# EAGLE board SL530 (EAGLE 7.6.0), part 1 of 2
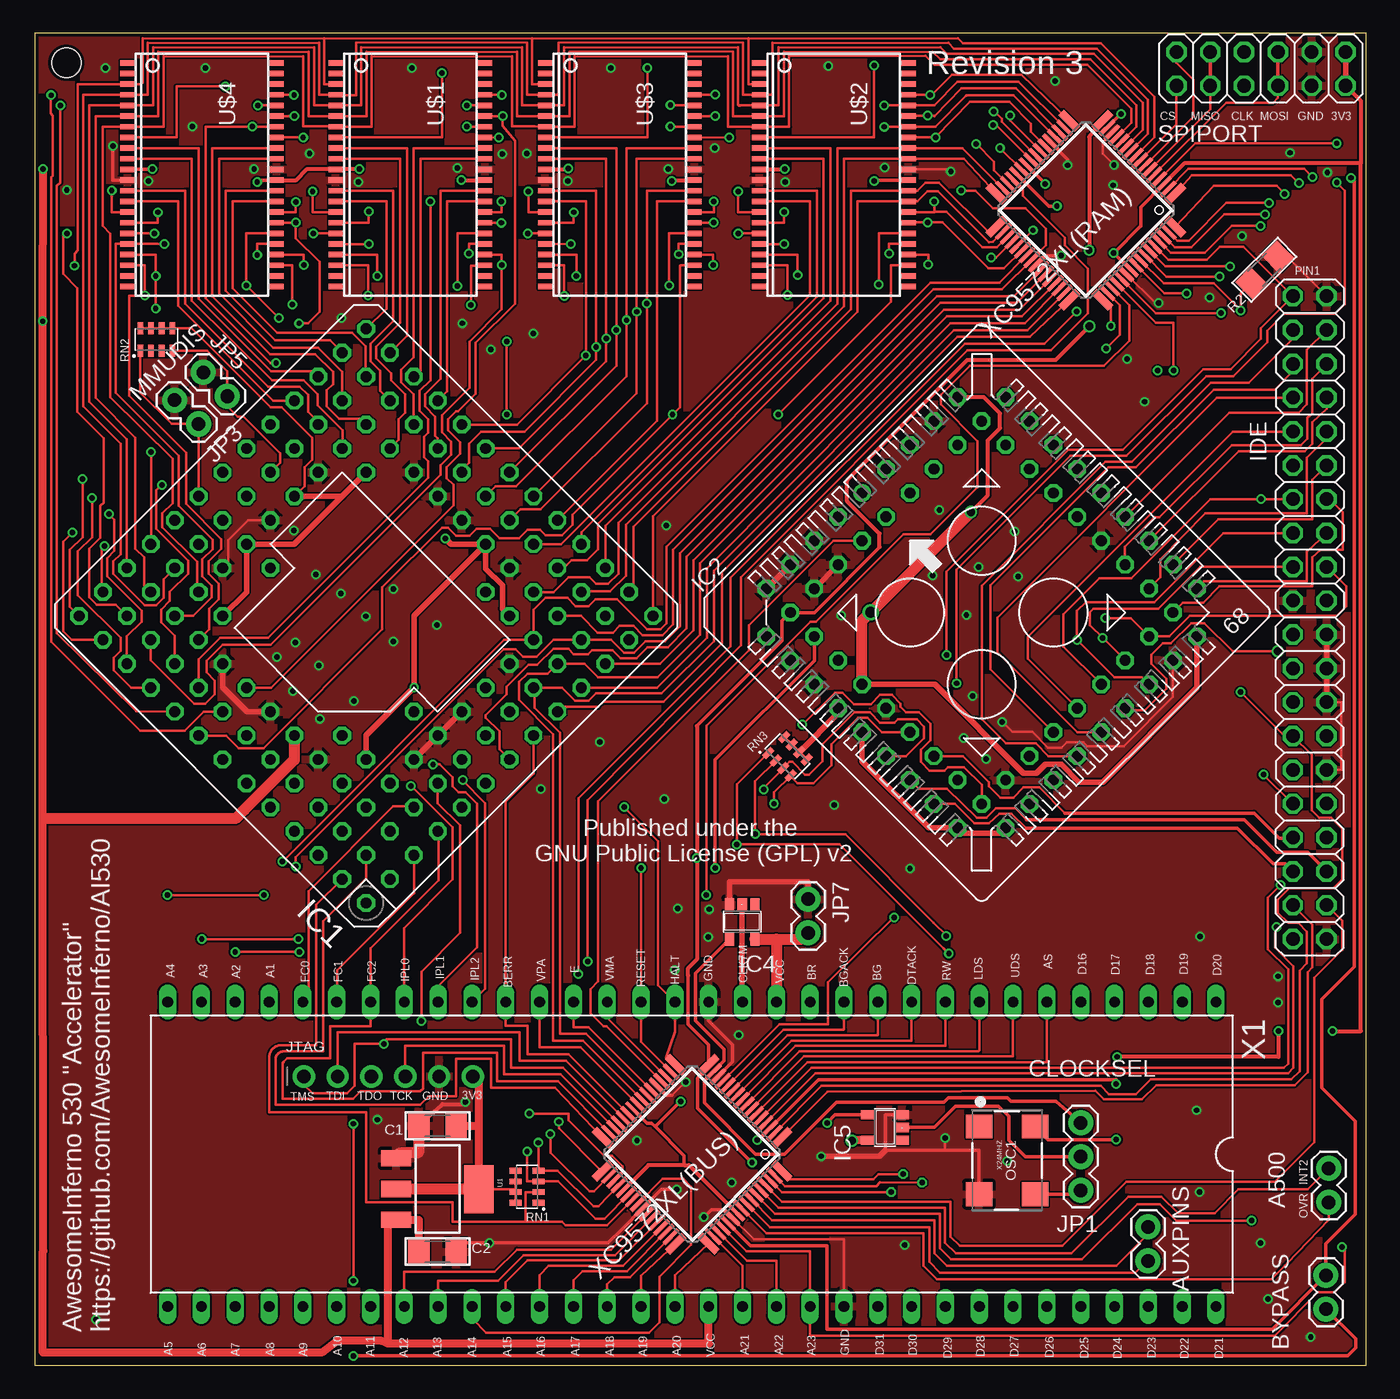
[diagram p3: board, top side]
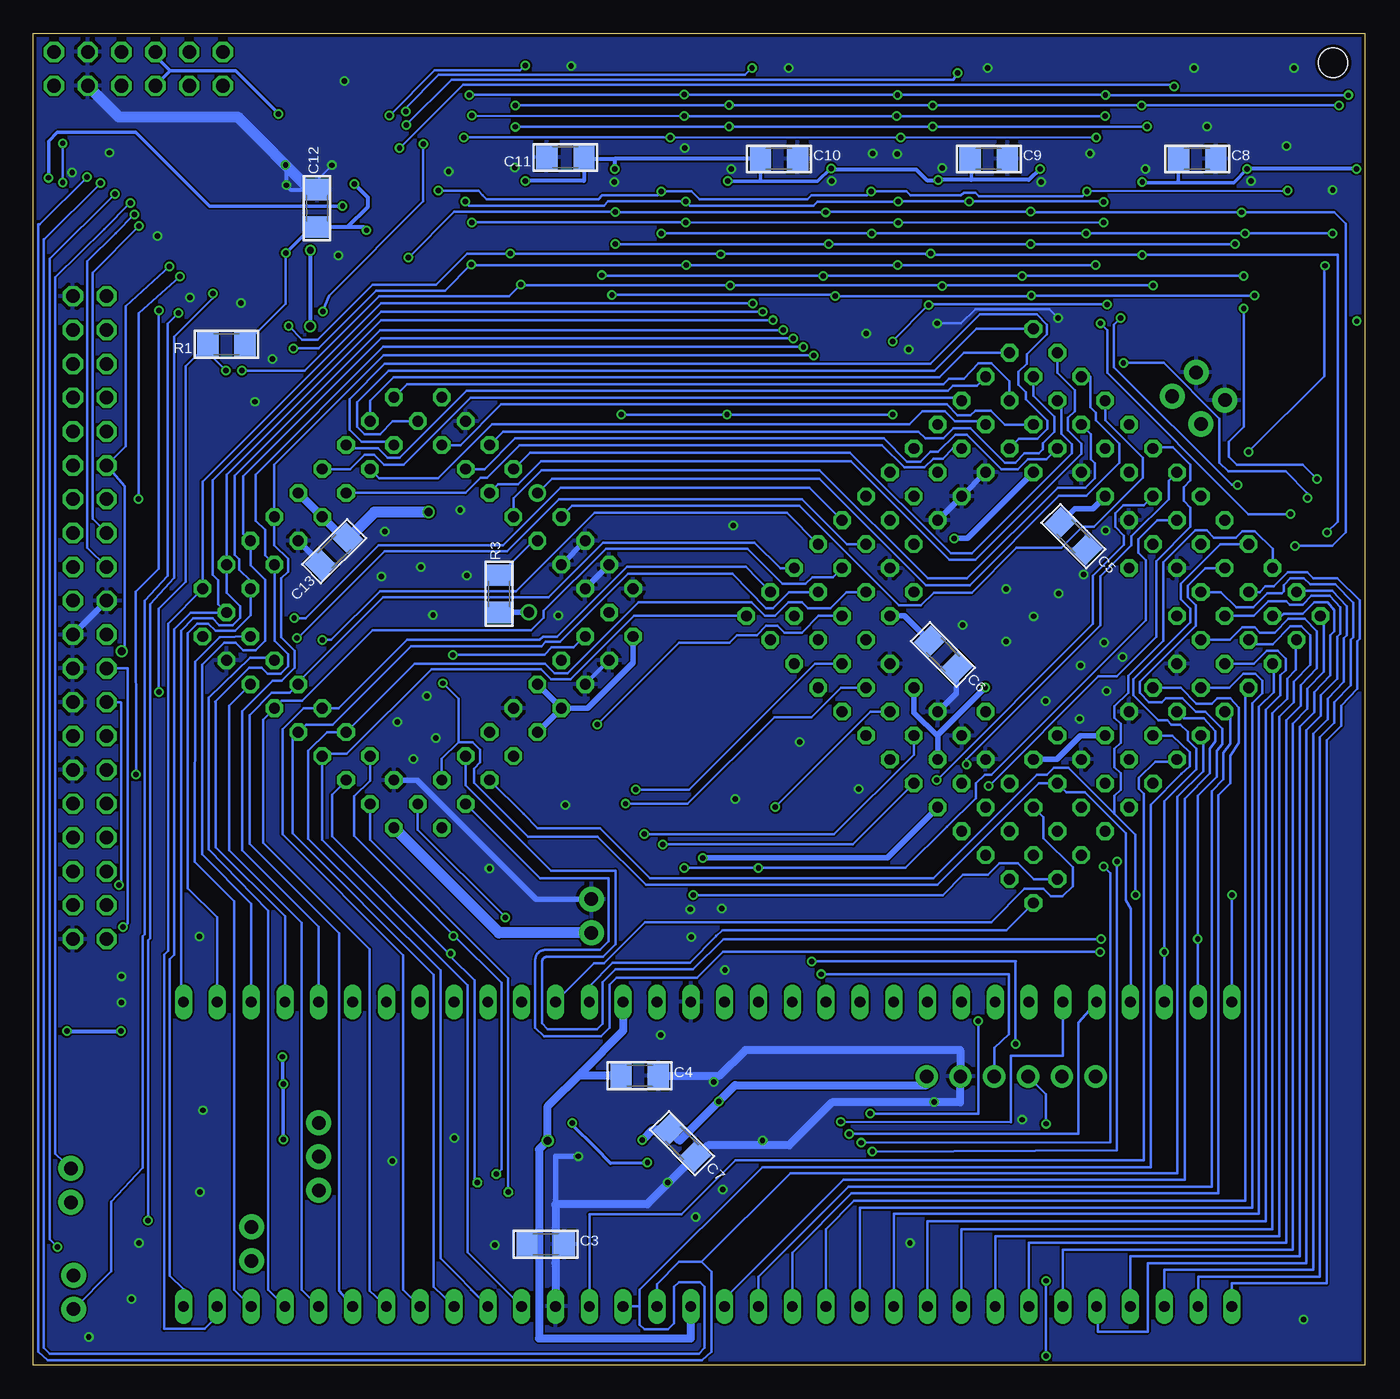
[diagram p4: board, bottom side, seen from below]

Size 100 x 100 mm. Coordinates in mm from the lower left corner, seen from the top.
Outline: 0,0 100,0 100,100 0,100 0,0
Copper layers (1*16): Top 0.035mm / dielectric 1.5mm / Bottom 0.035mm
Design rules "dirt_cheap_dirty_boards.v1 *": minimum track width 5mil, minimum drill 12mil, track to track 5mil, track to pad 5mil, pad to pad 5mil, via to via 5mil, smd to smd 0mil, copper to edge 10mil, drill to drill 10mil, minimum pad ring 10mil, minimum via ring 6mil, stop-mask expansion 2mil, vias tented up to drill 25mil, thermal gap 10mil
Holes 2.2 mm at 2.39,97.79

## Footprints (pad centres in the part's own frame; a part is rotated, then mirrored left to right if it is on the bottom)
1X02 = drill 1.016 pad 1.88: 1 0,0; 2 2.54,0
1206 = smd 1.6 x 1.8: 1 -1.4,0; 2 1.4,0
MPGA128 = drill 0.813 octagon: A01 -15.24,15.24; A02 -12.7,15.24; A03 -10.16,15.24; A04 -7.62,15.24; A05 -5.08,15.24; A06 -2.54,15.24; A07 0,15.24; A08 2.54,15.24; A09 5.08,15.24; A10 7.62,15.24; A11 10.16,15.24; A12 12.7,15.24; A13 15.24,15.24; B01 -15.24,12.7; B02 -12.7,12.7; B03 -10.16,12.7; B04 -7.62,12.7; B05 -5.08,12.7; B06 -2.54,12.7; B07 0,12.7; B08 2.54,12.7; B09 5.08,12.7; B10 7.62,12.7; B11 10.16,12.7; B12 12.7,12.7; B13 15.24,12.7; C01 -15.24,10.16; C02 -12.7,10.16; C03 -10.16,10.16; C04 -7.62,10.16; C05 -5.08,10.16; C06 -2.54,10.16; C07 0,10.16; C08 2.54,10.16; C09 5.08,10.16; C10 7.62,10.16; C11 10.16,10.16; C12 12.7,10.16; C13 15.24,10.16; D01 -15.24,7.62; D02 -12.7,7.62; D03 -10.16,7.62; D04 -7.62,7.62; D05 -5.08,7.62; D10 7.62,7.62; D11 10.16,7.62; D12 12.7,7.62; D13 15.24,7.62; E01 -15.24,5.08; E02 -12.7,5.08; E03 -10.16,5.08; E11 10.16,5.08; E12 12.7,5.08; E13 15.24,5.08; F01 -15.24,2.54; F02 -12.7,2.54; F03 -10.16,2.54; F04 -7.62,2.54; F10 7.62,2.54; F11 10.16,2.54; F12 12.7,2.54; F13 15.24,2.54; G01 -15.24,0; G02 -12.7,0; G03 -10.16,0; G11 10.16,0; G12 12.7,0; G13 15.24,0; H01 -15.24,-2.54; H02 -12.7,-2.54; H03 -10.16,-2.54; H11 10.16,-2.54; H12 12.7,-2.54; H13 15.24,-2.54; J01 -15.24,-5.08; J02 -12.7,-5.08; J03 -10.16,-5.08; J11 10.16,-5.08; J12 12.7,-5.08; J13 15.24,-5.08; K01 -15.24,-7.62; K02 -12.7,-7.62; K03 -10.16,-7.62; K04 -7.62,-7.62; K05 -5.08,-7.62; K10 7.62,-7.62; K11 10.16,-7.62; K12 12.7,-7.62; K13 15.24,-7.62; L01 -15.24,-10.16; L02 -12.7,-10.16; L03 -10.16,-10.16; L04 -7.62,-10.16; L05 -5.08,-10.16; L06 -2.54,-10.16; L07 0,-10.16; L08 2.54,-10.16; L09 5.08,-10.16; L10 7.62,-10.16; L11 10.16,-10.16; L12 12.7,-10.16; L13 15.24,-10.16; M01 -15.24,-12.7; M02 -12.7,-12.7; M03 -10.16,-12.7; M04 -7.62,-12.7; M05 -5.08,-12.7; M06 -2.54,-12.7; M07 0,-12.7; M08 2.54,-12.7; M09 5.08,-12.7; M10 7.62,-12.7; M11 10.16,-12.7; M12 12.7,-12.7; M13 15.24,-12.7; N01 -15.24,-15.24; N02 -12.7,-15.24; N03 -10.16,-15.24; N04 -7.62,-15.24; N05 -5.08,-15.24; N06 -2.54,-15.24; N07 0,-15.24; N08 2.54,-15.24; N09 5.08,-15.24; N10 7.62,-15.24; N11 10.16,-15.24; N12 12.7,-15.24; N13 15.24,-15.24
PLCC68-S = drill 0.813: 1 0,12.7 | drill 0.813 octagon: 2 0,10.16; 3 -2.54,12.7; 4 -2.54,10.16; 5 -5.08,12.7; 6 -5.08,10.16; 7 -7.62,12.7; 8 -7.62,10.16; 9 -10.16,12.7; 10 -12.7,10.16; 11 -10.16,10.16; 12 -12.7,7.62; 13 -10.16,7.62; 14 -12.7,5.08; 15 -10.16,5.08; 16 -12.7,2.54; 17 -10.16,2.54; 18 -12.7,0; 19 -10.16,0; 20 -12.7,-2.54; 21 -10.16,-2.54; 22 -12.7,-5.08; 23 -10.16,-5.08; 24 -12.7,-7.62; 25 -10.16,-7.62; 26 -12.7,-10.16; 27 -10.16,-12.7; 28 -10.16,-10.16; 29 -7.62,-12.7; 30 -7.62,-10.16; 31 -5.08,-12.7; 32 -5.08,-10.16; 33 -2.54,-12.7; 34 -2.54,-10.16; 35 0,-12.7; 36 0,-10.16; 37 2.54,-12.7; 38 2.54,-10.16; 39 5.08,-12.7; 40 5.08,-10.16; 41 7.62,-12.7; 42 7.62,-10.16; 43 10.16,-12.7; 44 12.7,-10.16; 45 10.16,-10.16; 46 12.7,-7.62; 47 10.16,-7.62; 48 12.7,-5.08; 49 10.16,-5.08; 50 12.7,-2.54; 51 10.16,-2.54; 52 12.7,0; 53 10.16,0; 54 12.7,2.54; 55 10.16,2.54; 56 12.7,5.08; 57 10.16,5.08; 58 12.7,7.62; 59 10.16,7.62; 60 12.7,10.16; 61 10.16,12.7; 62 10.16,10.16; 63 7.62,12.7; 64 7.62,10.16; 65 5.08,12.7; 66 5.08,10.16; 67 2.54,12.7; 68 2.54,10.16
SOT23-5 = smd 0.69 x 0.99: 1 -0.95,-1.29; 2 0,-1.29; 3 0.95,-1.29; 4 0.95,1.3; 5 -0.95,1.3
2X20 = drill 1.016 octagon: 1 -24.13,-1.27; 2 -24.13,1.27; 3 -21.59,-1.27; 4 -21.59,1.27; 5 -19.05,-1.27; 6 -19.05,1.27; 7 -16.51,-1.27; 8 -16.51,1.27; 9 -13.97,-1.27; 10 -13.97,1.27; 11 -11.43,-1.27; 12 -11.43,1.27; 13 -8.89,-1.27; 14 -8.89,1.27; 15 -6.35,-1.27; 16 -6.35,1.27; 17 -3.81,-1.27; 18 -3.81,1.27; 19 -1.27,-1.27; 20 -1.27,1.27; 21 1.27,-1.27; 22 1.27,1.27; 23 3.81,-1.27; 24 3.81,1.27; 25 6.35,-1.27; 26 6.35,1.27; 27 8.89,-1.27; 28 8.89,1.27; 29 11.43,-1.27; 30 11.43,1.27; 31 13.97,-1.27; 32 13.97,1.27; 33 16.51,-1.27; 34 16.51,1.27; 35 19.05,-1.27; 36 19.05,1.27; 37 21.59,-1.27; 38 21.59,1.27; 39 24.13,-1.27; 40 24.13,1.27
1X03 = drill 1.016 pad 1.88: 1 0,0; 2 2.54,0; 3 5.08,0
1X06_ROUND = drill 1 pad 1.676: 1 -6.35,0; 2 -3.81,0; 3 -1.27,0; 4 1.27,0; 5 3.81,0; 6 6.35,0
OSC_7X5MM = smd 1.8 x 2: 1 -2.54,-2.1; 2 2.54,-2.1; 3 2.54,2.1; 4 -2.54,2.1
RESCAXE80P320X160-8N = smd 0.9 x 0.425: 1 -0.85,1.2; 2 -0.85,0.4; 3 -0.85,-0.4; 4 -0.85,-1.2; 5 0.85,-1.2; 6 0.85,-0.4; 7 0.85,0.4; 8 0.85,1.2
2X06 = drill 1.016 octagon: 1 -6.35,-1.27; 2 -6.35,1.27; 3 -3.81,-1.27; 4 -3.81,1.27; 5 -1.27,-1.27; 6 -1.27,1.27; 7 1.27,-1.27; 8 1.27,1.27; 9 3.81,-1.27; 10 3.81,1.27; 11 6.35,-1.27; 12 6.35,1.27
SOT223 = smd 1.219 x 2.235: 1 -2.311,-3.099; 2 0,-3.099; 3 2.311,-3.099 | smd 3.6 x 2.2: 4 0,3.099
TSOP44-II = smd 0.4 x 1.092: 1 -8.4,-5.6; 2 -7.6,-5.6; 3 -6.8,-5.6; 4 -6,-5.6; 5 -5.2,-5.6; 6 -4.4,-5.6; 7 -3.6,-5.6; 8 -2.8,-5.6; 9 -2,-5.6; 10 -1.2,-5.6; 11 -0.4,-5.6; 12 0.4,-5.6; 13 1.2,-5.6; 14 2,-5.6; 15 2.8,-5.6; 16 3.6,-5.6; 17 4.4,-5.6; 18 5.2,-5.6; 19 6,-5.6; 20 6.8,-5.6; 21 7.6,-5.6; 22 8.4,-5.6; 23 8.4,5.6; 24 7.6,5.6; 25 6.8,5.6; 26 6,5.6; 27 5.2,5.6; 28 4.4,5.6; 29 3.6,5.6; 30 2.8,5.6; 31 2,5.6; 32 1.2,5.6; 33 0.4,5.6; 34 -0.4,5.6; 35 -1.2,5.6; 36 -2,5.6; 37 -2.8,5.6; 38 -3.6,5.6; 39 -4.4,5.6; 40 -5.2,5.6; 41 -6,5.6; 42 -6.8,5.6; 43 -7.6,5.6; 44 -8.4,5.6
DIL64 = drill 0.813 long: 1 -39.37,-11.43; 2 -36.83,-11.43; 3 -34.29,-11.43; 4 -31.75,-11.43; 5 -29.21,-11.43; 6 -26.67,-11.43; 7 -24.13,-11.43; 8 -21.59,-11.43; 9 -19.05,-11.43; 10 -16.51,-11.43; 11 -13.97,-11.43; 12 -11.43,-11.43; 13 -8.89,-11.43; 14 -6.35,-11.43; 15 -3.81,-11.43; 16 -1.27,-11.43; 17 1.27,-11.43; 18 3.81,-11.43; 19 6.35,-11.43; 20 8.89,-11.43; 21 11.43,-11.43; 22 13.97,-11.43; 23 16.51,-11.43; 24 19.05,-11.43; 25 21.59,-11.43; 26 24.13,-11.43; 27 26.67,-11.43; 28 29.21,-11.43; 29 31.75,-11.43; 30 34.29,-11.43; 31 36.83,-11.43; 32 39.37,-11.43; 33 39.37,11.43; 34 36.83,11.43; 35 34.29,11.43; 36 31.75,11.43; 37 29.21,11.43; 38 26.67,11.43; 39 24.13,11.43; 40 21.59,11.43; 41 19.05,11.43; 42 16.51,11.43; 43 13.97,11.43; 44 11.43,11.43; 45 8.89,11.43; 46 6.35,11.43; 47 3.81,11.43; 48 1.27,11.43; 49 -1.27,11.43; 50 -3.81,11.43; 51 -6.35,11.43; 52 -8.89,11.43; 53 -11.43,11.43; 54 -13.97,11.43; 55 -16.51,11.43; 56 -19.05,11.43; 57 -21.59,11.43; 58 -24.13,11.43; 59 -26.67,11.43; 60 -29.21,11.43; 61 -31.75,11.43; 62 -34.29,11.43; 63 -36.83,11.43; 64 -39.37,11.43
VQ64 = smd 1.754 x 0.554: 1 -5.627,3.877; 16 -5.627,-3.877; 33 5.627,-3.877; 48 5.627,3.877 | smd 1.5 x 0.3: 2 -5.5,3.25; 3 -5.5,2.75; 4 -5.5,2.25; 5 -5.5,1.75; 6 -5.5,1.25; 7 -5.5,0.75; 8 -5.5,0.25; 9 -5.5,-0.25; 10 -5.5,-0.75; 11 -5.5,-1.25; 12 -5.5,-1.75; 13 -5.5,-2.25; 14 -5.5,-2.75; 15 -5.5,-3.25; 34 5.5,-3.25; 35 5.5,-2.75; 36 5.5,-2.25; 37 5.5,-1.75; 38 5.5,-1.25; 39 5.5,-0.75; 40 5.5,-0.25; 41 5.5,0.25; 42 5.5,0.75; 43 5.5,1.25; 44 5.5,1.75; 45 5.5,2.25; 46 5.5,2.75; 47 5.5,3.25 | smd 0.554 x 1.754: 17 -3.877,-5.627; 32 3.877,-5.627; 49 3.877,5.627; 64 -3.877,5.627 | smd 0.3 x 1.5: 18 -3.25,-5.5; 19 -2.75,-5.5; 20 -2.25,-5.5; 21 -1.75,-5.5; 22 -1.25,-5.5; 23 -0.75,-5.5; 24 -0.25,-5.5; 25 0.25,-5.5; 26 0.75,-5.5; 27 1.25,-5.5; 28 1.75,-5.5; 29 2.25,-5.5; 30 2.75,-5.5; 31 3.25,-5.5; 50 3.25,5.5; 51 2.75,5.5; 52 2.25,5.5; 53 1.75,5.5; 54 1.25,5.5; 55 0.75,5.5; 56 0.25,5.5; 57 -0.25,5.5; 58 -0.75,5.5; 59 -1.25,5.5; 60 -1.75,5.5; 61 -2.25,5.5; 62 -2.75,5.5; 63 -3.25,5.5

## Placement (x,y rotation side)
A500  A500  [1X02]  97.18,12.24 90 top
AUXPINS  AUXPINS  [1X02]  83.62,10.39 270 top
BYPASS  BYPASS  [1X02]  96.98,6.76 270 top
C1  10uF  [1206]  30.25,17.98 180 top
C2  10uF  [1206]  30.25,8.53 0 top
C3  10uF  [1206]  61.52,9.09 0 bottom
C4  10uF  [1206]  54.46,21.74 0 bottom
C5  10uF  [1206]  21.89,62.26 315 bottom
C6  10uF  [1206]  31.67,53.37 315 bottom
C7  10uF  [1206]  51.28,16.69 315 bottom
C8  10uF  [1206]  12.6,90.58 0 bottom
C9  10uF  [1206]  28.24,90.58 0 bottom
C10  10uF  [1206]  43.99,90.58 0 bottom
C11  10uF  [1206]  60.05,90.68 180 bottom
C12  10uF  [1206]  78.69,86.87 90 bottom
C13  10uF  [1206]  77.42,61.11 225 bottom
IC1  [MPGA128]  24.89,56.26 135 top
IC2  [PLCC68-S]  71.12,56.52 45 top
IC4  74LVC1G17DBV  [SOT23-5]  53.14,33.3 180 top
IC5  74LVC1G17DBV  [SOT23-5]  63.86,17.86 90 top
IDE  IDE CONNECTOR  [2X20]  95.76,56.13 270 top
JP1  CLOCKSEL  [1X03]  78.56,18.21 270 top
JP3  MMUDIS  [1X02]  10.52,72.47 315 top
JP5  CDIS  [1X02]  12.67,74.55 315 top
JP7  EXT5V  [1X02]  58.09,35 270 top
JTAG  JTAG  [1X06_ROUND]  26.57,21.69 0 top
OSC1  X24MHZ  [OSC_7X5MM]  73.03,15.39 270 top
R1  47K  [1206]  85.5,76.66 180 bottom
R2  47K  [1206]  92.35,82.25 225 top
R3  10K  [1206]  65.02,57.91 90 bottom
RN1  CAY16-103J4LF  [RESCAXE80P320X160-8N]  36.98,13.41 180 top
RN2  CAY16-103J4LF  [RESCAXE80P320X160-8N]  9.14,77.01 90 top
RN3  CAY16-103J4LF  [RESCAXE80P320X160-8N]  56.54,45.72 45 top
SPIPORT  SPI PORT  [2X06]  92.1,97.33 180 top
U1  LM1117  [SOT223]  30.25,13.23 270 top
U$1  AS7C4096A-12TCN  [TSOP44-II]  28.22,89.38 270 top
U$2  AS7C4096A-12TCN  [TSOP44-II]  60.02,89.38 270 top
U$3  AS7C4096A-12TCN  [TSOP44-II]  43.94,89.38 270 top
U$4  AS7C4096A-12TCN  [TSOP44-II]  12.57,89.38 270 top
X1  MC68000  [DIL64]  49.35,15.85 180 top
XC9572XL(BUS)  XC9572XL-VQ64  [VQ64]  49.38,15.85 225 top
XC9572XL(RAM)  XC9572XL-VQ64  [VQ64]  78.94,86.72 225 top

## Tracks (layer width: path | path; a pad name or v marks a point on that pad's centre or on a via)
A0  (via drill 0.41)
  Top 0.203: IC1.A02 21.16,34.57 21.16,24.03 18.49,24.03 arc90 17.63,23.16 17.63,19 24.89,19 24.89,12.24 31.39,12.24 31.39,10.77 36.88,10.77 | 36.88,10.77 39.62,10.77 39.88,10.52 42.98,10.52 XC9572XL(BUS).39 | RN1.2 36.88,13.01 36.88,10.77 | v50.44,35.31 50.44,48.01 58.27,55.83 58.67,55.83 65.23,62.38 67.26,62.38 70.81,65.94 70.81,69.39 68.07,72.14 68.07,72.85 70.26,75.03 80.31,75.03 82.19,76.91 82.19,79.58 XC9572XL(RAM).51
  Bottom 0.203: IC1.A02 24.87,36.5 26.06,37.69 27.43,37.69 28.3,36.83 30.18,36.83 31.7,35.31 v50.44,35.31
A1  (via drill 0.41, 0.41 pad 0.61)
  Top 0.203: v69.24,51.21 69.24,59.74 77.78,68.28 81.99,68.28 87.99,74.27 90.02,74.27 92.56,76.81 92.56,77.67 93.83,78.94 97.69,78.94 98.4,79.65 98.4,88.19 v97.79,88.8 | XC9572XL(RAM).4 87.15,91.75 v97.79,91.75
  Bottom 0.203: X1.29 17.58,27.3 17.58,34.29 17.93,34.9 17.93,39.93 21.03,43.03 22.43,43.03 IC1.C04 24.48,43.69 32.11,36.07 54,36.07 57.61,39.67 62.84,39.67 66.9,43.74 66.9,44.81 66.45,45.26 66.45,46.23 67,46.79 68.07,46.79 | 68.07,46.79 69.32,45.53 IC2.25 | 68.07,46.79 68.07,50.04 v69.24,51.21 | v97.79,91.75 v97.79,88.8
A2  (via drill 0.41 pad 0.61)
  Top 0.152: 8.12,99.62 21.74,99.62 37.36,99.62 53.59,99.62 69.34,99.62
  Top 0.178: 69.34,99.62 69.7,99.26
  Top 0.203: 74.47,40.34 73.36,41.4 72.44,41.4 71.68,40.69 70.56,40.69 69.11,42.15 IC2.24 | U$1.3 21.74,96.18 21.74,99.62 | 37.36,99.62 37.36,96.18 U$3.3 | 8.12,99.62 8.12,96.28 8.02,96.18 U$4.3 3.25,96.18 3.25,83.72 3,83.46 v3,82.55 | 53.59,99.62 53.59,96.18 U$2.3 | v15.06,31.04 v19.89,31.04 | IC1.D13 8.66,61.65 8.74,61.73 v8.74,68.58 | 69.7,99.26 80.06,99.26 84.07,95.25 84.07,92.2 XC9572XL(RAM).9
  Top 0.254: 74.47,40.34 90.32,40.34 93.02,37.64 93.93,37.64 IDE.35
  Bottom 0.203: IC1.D13 10.84,61.65 13.82,58.67 13.82,57.51 13.11,56.79 13.11,55.78 17.37,51.51 17.37,50.29 15.49,48.41 14.83,48.41 14.53,48.11 13.87,48.11 13.31,47.55 13.31,46.94 12.65,46.28 12.65,44.76 15.06,42.34 v15.06,31.04 X1.30 | IC2.24 61.96,36.58 56.79,36.58 56.79,31.85 57.45,31.19 61.54,31.19 arc-90 62.31,30.43 62.31,25.35 61.65,24.69 57.38,24.69 56.72,25.35 56.72,28.57 56.19,29.11 50.14,29.11 48.21,31.04 v19.89,31.04 | v8.74,68.58 3.05,74.27 3.05,82.5 v3,82.55
A3  (via drill 0.41 pad 0.61)
  Top 0.152: 55.42,99.29 68.61,99.29 | 8.51,99.29 21.36,99.29 | 36.98,99.29 24.13,99.29 | 53.21,99.29 39.34,99.29
  Top 0.178: 68.61,99.29 69.04,98.86
  Top 0.203: 77.37,41.45 75.44,43.38 74.27,43.38 73.51,42.62 72.54,42.62 71.68,43.48 71.68,43.79 69.73,45.74 IC2.23 | 8.51,99.29 8.51,95.38 U$4.4 3.66,95.38 3.66,71.98 6.45,69.19 6.45,60.91 5.89,60.35 5.89,59.44 8.28,57.05 9.14,57.05 9.7,57.61 9.7,59.03 IC1.D12 | 21.36,99.29 21.36,95.38 U$1.4 23.13,95.35 24.13,95.35 24.13,99.29 | 36.98,99.29 36.98,95.38 U$3.4 39.34,95.38 39.34,99.29 | 53.21,99.29 53.21,95.38 U$2.4 54.44,95.4 55.42,95.4 55.42,99.29 | v12.55,32 v19.81,32 | 69.04,98.86 79.76,98.86 83.62,95 83.62,92.45 XC9572XL(RAM).10
  Top 0.254: 77.37,41.45 91.59,41.45 93.47,39.57 94.44,39.57 IDE.33
  Bottom 0.203: IC1.D12 11.98,59.85 13.31,58.52 13.31,57.66 12.7,57.05 12.7,55.52 16.92,51.31 16.92,50.49 16.2,49.78 15.24,49.78 14.94,50.09 13.72,50.09 12.7,49.07 11.99,49.07 10.72,47.8 10.72,46.63 11.12,46.13 11.12,44.2 12.55,42.77 v12.55,32 12.55,27.3 X1.31 | IC2.23 67.53,43.55 61.11,37.13 56.29,37.13 56.29,31.6 57.2,30.68 61.39,30.68 arc-90 61.8,30.28 61.8,25.68 61.37,25.25 57.66,25.25 57.25,25.65 57.25,28.75 56.29,29.72 50.44,29.72 48.16,32 v19.81,32
A4  (via drill 0.41)
  Top 0.152: 55.88,98.96 68.02,98.96 | 39.75,98.96 52.83,98.96 | 8.89,98.96 20.98,98.96 | 24.54,98.96 36.6,98.96
  Top 0.178: 68.02,98.96 68.53,98.45
  Top 0.203: IC2.22 66.39,43.28 68.53,43.28 70.76,41.1 71.48,41.1 72.19,41.81 73.66,41.81 74.47,40.95 | 39.75,98.96 39.75,94.58 U$3.5 36.6,94.59 36.6,98.96 | 52.83,98.96 52.83,94.64 arc90 52.99,94.58 U$2.5 55.88,94.58 55.88,98.96 | 8.89,98.96 8.89,94.58 U$4.5 4.12,94.58 4.12,72.34 6.93,69.52 IC1.C13 | 20.98,98.96 20.98,94.58 U$1.5 24.54,94.58 24.54,98.96 | v17.22,35.31 v9.98,35.31 | 68.53,98.45 79.55,98.45 83.21,94.79 83.21,92.76 XC9572XL(RAM).11
  Top 0.254: 74.47,40.95 90.83,40.95 93.27,38.51 95.61,38.51 IDE.36
  Bottom 0.203: IC1.C13 6.93,61.29 8.28,62.64 9.2,62.64 9.7,62.13 11.33,62.13 11.89,62.69 12.75,62.69 15.14,60.3 15.14,54.41 17.78,51.77 17.78,50.49 18.8,49.48 18.8,48.62 18.34,48.16 18.34,46.74 18.8,46.28 18.8,44.91 18.34,44.45 18.34,43.23 18.8,42.77 18.8,41.4 | v17.22,35.31 17.22,39.83 18.8,41.4 | v9.98,35.31 X1.32 | IC2.22 63.19,41.4 62.13,40.34 57.45,40.34 53.7,36.58 32.41,36.58 24.64,44.35 23.88,44.35 23.37,44.86 22.25,44.86 18.8,41.4
A5
  Top 0.152: 9.27,98.63 20.57,98.63 | 52.45,98.63 40.16,98.63 | 24.92,98.63 36.22,98.63 | 56.29,98.63 67.44,98.63
  Top 0.178: 67.44,98.63 68.02,98.04
  Top 0.203: 56.29,98.63 56.29,93.78 U$2.6 52.45,93.78 52.45,98.63 | 9.27,98.63 9.27,93.78 U$4.6 4.57,93.78 4.57,72.64 7.57,69.65 7.57,61.32 8.23,60.66 8.23,58.55 IC1.C12 | 20.57,98.63 20.57,93.78 23.13,93.78 U$1.6 24.92,93.78 24.92,98.63 | 40.16,98.63 40.16,93.78 37.53,93.78 | 37.53,93.78 U$3.6 | 36.22,98.63 36.22,93.78 37.53,93.78 | 68.02,98.04 79.3,98.04 82.75,94.59 82.75,93 XC9572XL(RAM).12
  Bottom 0.203: X1.33 9.98,6.15 2.87,6.15 2.87,46.91 1.78,48.01 1.78,49.53 0.56,50.8 0.56,54.36 0.38,54.53 0.38,57.45 2.08,59.08 3.86,59.08 4.32,59.54 5.79,59.54 6.86,58.47 7.47,58.47 7.88,58.06 IC1.C12
A6
  Top 0.152: 9.68,98.27 20.17,98.27 | 25.3,98.27 35.84,98.27 | 40.56,98.27 52.07,98.27 | 56.67,98.3 66.9,98.3
  Top 0.178: 66.9,98.3 67.56,97.64
  Top 0.203: 9.68,98.27 9.68,92.98 U$4.7 5.13,92.98 5.13,85.55 5.69,84.94 5.69,72.69 10.36,68.07 10.36,64.72 9.58,63.96 9.58,62.92 12.19,60.33 12.19,58.19 IC1.D11 | 20.17,98.27 20.17,93.02 23.13,93.02 U$1.7 25.3,92.98 25.3,98.27 | 35.84,98.27 35.84,93.02 37.53,93.02 U$3.7 40.56,92.98 40.56,98.27 | 52.07,98.27 52.07,92.98 U$2.7 56.67,92.98 56.67,98.3 | 67.56,97.64 79.05,97.64 82.35,94.34 82.35,93.3 XC9572XL(RAM).13
  Bottom 0.203: X1.34 12.52,6.66 3.38,6.66 3.38,47.17 2.29,48.26 2.29,49.78 1.07,51.05 1.07,54.46 0.86,54.66 0.86,57.25 2.23,58.62 4.12,58.62 4.57,59.08 5.59,59.08 6.1,58.57 6.1,58.12 6.25,57.96 7.32,57.96 8.38,56.9 9.65,56.9 10.81,58.06 IC1.D11
A7  (via drill 0.41, 0.41 pad 0.41, 0.41 pad 0.61)
  Top 0.203: U$2.16 56.29,85.78 v56.29,86.59 | U$3.16 40.49,85.78 v40.49,86.56 | U$1.16 25.09,85.78 v25.09,86.61 | v9.25,86.56 9.25,85.78 U$4.16 | IC1.B13 5.03,58.16 5.03,61.31 v5.23,61.52 | v71.83,83.16 72.2,83.16 XC9572XL(RAM).36
  Bottom 0.203: X1.35 15.06,7.16 3.89,7.16 3.89,47.42 2.79,48.51 2.79,50.04 1.57,51.31 1.57,54.59 1.35,54.81 1.35,57 2.44,58.17 5.03,58.17 IC1.B13 | v71.83,83.16 68.4,86.59 v56.29,86.59 56.29,86.56 v40.49,86.56 40.49,86.61 v25.09,86.61 25.09,86.56 v9.25,86.56 2.29,86.56 1.42,85.7 1.42,62.53 2.44,61.52 v5.23,61.52
A8  (via drill 0.41, 0.41 pad 0.41)
  Top 0.203: U$1.17 v20.93,84.98 | v8.99,84.98 U$4.17 | U$3.17 v37.03,84.98 | v52.83,84.98 U$2.17 | IC1.B12 6.09,57.1 4.67,57.1 4.12,57.66 4.12,61.32 4.93,62.13 4.93,64.52 5.18,64.77 5.18,69.6 3.2,71.58 3.2,80.87 2.13,81.94 2.13,84.98 v2.44,84.98
  Bottom 0.203: v52.83,84.98 v37.03,84.98 v20.93,84.98 v8.99,84.98 v2.44,84.98 | X1.36 17.6,8.18 4.9,8.18 4.9,47.93 3.81,49.02 3.81,50.55 2.59,51.82 2.59,54.81 2.31,55.09 2.31,56.69 2.79,57.3 3.81,57.3 4.67,56.44 6.1,56.44 6.27,56.26 IC1.B12
A9  (via drill 0.41 pad 0.41)
  Top 0.203: v56.29,84.18 54.48,84.18 U$2.18 | v9.75,84.18 9.24,84.18 U$4.18 6.1,84.18 6.1,73 10.82,68.28 10.82,64.52 13.36,61.98 13.36,61.27 12.6,60.5 12.6,59.23 13.31,58.52 13.31,57.66 11.91,56.26 IC1.C11 | v25.09,84.18 23.13,84.18 U$1.18 | v40.28,84.18 U$3.18
  Bottom 0.203: v56.29,84.18 v40.28,84.18 v25.09,84.18 v9.75,84.18 | IC1.C11 8.36,56.26 7.26,57.35 5.89,57.35 5.64,57.1 4.67,57.1 4.01,57.76 2.64,57.76 1.83,56.9 1.83,54.94 2.08,54.69 2.08,51.56 3.3,50.29 3.3,48.77 4.39,47.68 4.39,7.67 16.31,7.67 16.31,2.54 20.07,2.54 20.07,4.42 X1.37
A10  (via drill 0.41 pad 0.41, 0.41 pad 0.61)
  Top 0.203: U$4.19 9.09,83.38 v9.09,81.79 v9.09,79.35 | U$1.19 25.73,83.38 v25.73,81.79 | U$3.19 40.69,83.38 v40.69,81.79 | U$2.19 57.3,83.38 v57.3,81.84 | IC1.A13 2.64,56.96 2.64,61.21 3.61,62.18 v3.61,66.55
  Bottom 0.203: v9.09,81.79 v25.73,81.79 v40.69,81.79 57.3,81.79 v57.3,81.84 | IC1.A13 3.1,56.07 3.1,52.07 4.32,50.8 4.32,49.28 5.41,48.18 5.41,8.69 22.68,8.69 X1.38 | v9.09,79.35 9.09,70.46 10.21,69.34 10.21,68.22 9.6,67.61 4.67,67.61 v3.61,66.55
A11  (via drill 0.41 pad 0.41)
  Top 0.203: U$4.20 8.28,82.58 v8.28,80.31 7.11,80.31 7.11,72.8 11.38,68.53 11.38,64.67 14.02,62.03 14.02,61.32 13.06,60.35 13.06,59.44 13.82,58.67 13.82,57.51 13.11,56.79 13.11,55.25 IC1.C10 | U$1.20 25.04,82.58 v25.04,80.31 | U$3.20 39.78,82.58 v39.78,80.26 | U$2.20 56.54,82.58 v56.54,80.37
  Bottom 0.203: X1.39 25.22,9.2 5.92,9.2 5.92,48.44 4.83,49.53 4.83,51.05 3.61,52.32 3.61,55.12 4.52,56.03 5.74,56.03 6.76,55.02 7.87,55.02 8.28,55.42 9.2,55.42 10.15,54.47 IC1.C10 | v8.28,80.31 v25.04,80.31 25.35,80.31 25.4,80.26 v39.78,80.26 39.88,80.37 v56.54,80.37
A12  (via drill 0.41, 0.41 pad 0.41)
  Top 0.203: U$4.26 20.22,83.38 v20.22,82.6 | U$3.26 50.95,83.38 v50.95,82.6 | U$2.26 67.11,83.38 v67.11,82.65 | X1.40 27.76,7.01 34.54,7.01 36.22,8.69 43.27,8.69 XC9572XL(BUS).42 | U$1.26 35.08,83.38 v35.08,82.6 35.08,79.27 32.66,76.86 32.66,73.41 30.58,71.32 30.58,70.05 31.29,69.34 31.29,68.38 30.48,67.56 30.48,66.85 17.73,54.1 14.12,54.1 12.9,52.88 12.9,52.02 13.51,51.41 13.51,50.39 12.8,49.68 11.99,49.68 8.73,52.94 IC1.B11 | XC9572XL(RAM).50 81.48,79.58 81.48,77.37 v80.47,76.35
  Bottom 0.203: v20.22,82.6 v35.08,82.6 v50.95,82.6 67.11,82.6 v67.11,82.65 69.09,80.67 74.27,80.67 78.59,76.35 v80.47,76.35 | X1.40 27.76,9.7 6.43,9.7 6.43,48.69 5.33,49.78 5.33,51.31 4.12,52.58 4.12,54.81 4.78,55.47 5.59,55.47 6.91,54.15 8.41,54.15 IC1.B11
A13  (via drill 0.41, 0.41 pad 0.41, 0.41 pad 0.61)
  Top 0.203: U$4.27 16.71,84.18 v16.71,83.36 | U$1.27 32.61,84.18 v32.61,83.46 | U$3.27 48.36,84.18 v48.36,83.41 | X1.41 30.3,6.35 34.8,6.35 36.73,8.28 43.58,8.28 XC9572XL(BUS).43 | IC1.A12 2.79,54.47 2.13,55.12 2.13,61.82 v2.85,62.53 | v64.16,83.46 64.16,84.18 U$2.27 | XC9572XL(RAM).49 80.82,79.53 v80.82,78.03
  Bottom 0.203: 48.11,83.46 v32.61,83.46 32.92,83.36 v16.71,83.36 2.03,83.36 2.03,63.35 v2.85,62.53 | 48.11,83.46 v48.36,83.41 | 48.11,83.46 v64.16,83.46 67.41,83.46 69.75,81.13 74.52,81.13 78.64,77.01 79.81,77.01 v80.82,78.03 | X1.41 30.3,10.21 6.93,10.21 6.93,48.95 5.84,50.04 5.84,51.56 5.18,52.22 5.18,54.42 IC1.A12
A14  (via drill 0.41, 0.41 pad 0.41, 0.41 pad 0.61)
  Top 0.203: U$4.28 15.9,84.98 v15.9,81.08 v18.34,78.64 | U$1.28 31.75,84.98 v31.75,81.03 | U$3.28 47.65,84.98 v47.65,81.08 | IC1.B10 10.52,54.75 9.5,55.78 9.5,56.74 10.16,57.4 10.16,58.06 11.53,59.44 11.53,60.4 9.14,62.79 9.14,65.68 v9.55,66.09 | U$2.28 63.4,84.98 v63.4,81.13 | XC9572XL(BUS).40 47.17,13.99 48.72,13.99 49.3,13.41 49.3,9.04 46.91,6.66 46.91,3.23 46.15,2.46 33.91,2.46 32.92,3.45 32.92,4.34 X1.42
  Bottom 0.203: 32.26,81.08 v31.75,81.03 | 32.26,81.08 v47.65,81.08 63.4,81.08 v63.4,81.13 64.26,80.26 74.02,80.26 79.6,74.68 v84.33,74.68 | X1.42 32.84,10.82 7.44,10.82 7.44,49.2 6.35,50.29 6.35,51.82 5.94,52.17 5.94,53.03 6.55,53.65 7.37,53.65 8.34,52.67 IC1.B10 | 32.26,81.08 v15.9,81.08 | v18.34,78.64 18.85,78.13 18.85,74.93 10.01,66.09 v9.55,66.09
A15  (via drill 0.41 pad 0.41, 0.41 pad 0.61)
  Top 0.203: U$4.29 19.61,85.78 v19.61,85.8 19.61,84.63 21.39,82.86 21.39,79.1 20.52,78.23 v19.86,78.23 | v51,85.8 50.98,85.78 U$3.29 | U$1.29 34.84,85.78 v35.05,85.78 | IC1.A11 6.93,54.73 8.03,55.83 8.03,56.64 5.44,59.23 5.44,60.6 5.99,61.16 5.99,63.5 v5.59,63.91 | XC9572XL(BUS).44 43.88,7.87 37.03,7.87 35.38,6.22 X1.43 | U$2.29 65.64,85.8 v67.06,85.8 68.17,85.8 71.63,82.35 72.81,82.35 XC9572XL(RAM).38
  Bottom 0.203: v19.61,85.8 v35.05,85.78 v51,85.8 v67.06,85.8 | X1.43 35.38,11.38 7.95,11.38 7.95,49.45 6.86,50.55 6.86,52.59 IC1.A11 | v5.59,63.91 8.74,63.91 19.36,74.52 19.36,77.72 v19.86,78.23
A16  (via drill 0.41 pad 0.41, 0.41 pad 0.61)
  Top 0.203: U$2.30 67.56,86.58 | 67.56,86.58 v67.56,87.38 | U$3.30 51,86.58 v51,87.38 | U$4.30 19.61,86.58 v19.61,87.33 | 67.56,86.58 67.59,86.61 68.48,86.61 71.17,83.92 72.26,83.92 XC9572XL(RAM).35 | U$1.30 35.05,86.58 v35.05,87.38 | IC1.B09 12.32,53.01 13.92,54.61 17.53,54.61 29.57,66.65 29.57,67.87 29.26,68.17 29.26,69.7 29.57,70 29.57,71.02 28.91,71.68 28.91,73.15 29.72,73.97 v29.72,87.38 | XC9572XL(BUS).45 44.18,7.47 38.61,7.47 37.92,6.78 X1.44
  Bottom 0.203: X1.44 37.92,11.84 8.46,11.84 8.46,49.71 7.72,50.44 7.72,51.41 8.23,51.92 9.14,51.92 10.19,50.87 IC1.B09 | v19.61,87.33 19.66,87.38 v29.72,87.38 v35.05,87.38 35.08,87.35 41.12,87.35 41.4,87.07 50.7,87.07 v51,87.38 56.84,87.38 57.15,87.07 67.26,87.07 v67.56,87.38
A17  (via drill 0.41 pad 0.41, 0.41 pad 0.61)
  Top 0.203: U$4.38 v16.36,92.99 12.85,92.99 12.85,80.11 17.73,75.23 17.75,75.26 v18.14,75.26 | U$1.38 v32.46,92.99 | v47.75,92.99 U$3.38 | v63.8,92.98 U$2.38 67.63,92.98 69.95,95.3 arc-90 70,95.35 73.49,95.35 XC9572XL(RAM).20 | IC1.A10 7.24,50.87 5.94,52.17 5.94,53.14 6.45,53.65 6.45,54.61 3.25,57.81 3.25,61.11 4.32,62.18 v4.32,65.13 | XC9572XL(BUS).46 44.48,7.06 41.15,7.06 40.46,6.38 X1.45
  Bottom 0.203: v63.8,92.98 v47.75,92.99 v32.46,92.99 v16.36,92.99 | X1.45 40.46,10.24 38.35,12.34 8.97,12.34 8.97,50.63 IC1.A10 | v4.32,65.13 4.32,65.48 5.94,67.11 10.26,67.11 10.92,67.77 10.92,71.07 15.11,75.26 v18.14,75.26
A18  (via drill 0.41 pad 0.41)
  Top 0.203: U$3.39 v51.1,93.78 | v19.51,93.78 U$4.39 | U$2.39 65.67,93.83 v67.06,93.83 67.53,93.83 67.57,93.78 69.6,95.86 73.69,95.86 XC9572XL(RAM).19 | IC1.C08 17.75,50.87 31.45,64.57 31.45,66.09 30.94,66.6 30.94,67.41 31.95,68.43 31.95,69.29 31.04,70.21 31.04,71.02 31.65,71.63 31.8,71.63 33.12,72.95 33.12,76.76 36.07,79.7 36.07,91.95 35.15,93.07 v35.15,93.78 U$1.39 | XC9572XL(BUS).47 44.73,6.6 43.54,6.6 43,6.07 X1.46
  Bottom 0.203: v19.51,93.78 v35.15,93.78 v51.1,93.78 v67.06,93.83 | X1.46 43,8.46 38.56,12.9 11,12.9 11,42.8 10.11,43.69 10.11,45.77 9.47,46.74 9.47,49.38 10.11,50.09 11.07,50.09 11.48,49.68 12.65,49.68 13.84,50.87 IC1.C08
A19  (via drill 0.41 pad 0.41, 0.41 pad 0.61)
  Top 0.203: U$3.40 47.78,94.58 v47.75,94.61 | v63.8,94.58 U$2.40 67.56,94.58 69.29,96.37 73.89,96.37 XC9572XL(RAM).18 | U$1.40 v32.46,94.59 | IC1.A09 7.62,49.1 1.65,54.97 1.68,54.99 1.68,88.54 1.93,88.8 v1.93,94.59 | v16.76,94.59 U$4.40 | XC9572XL(BUS).48 45.54,6.71 X1.47
  Bottom 0.203: v63.8,94.58 v47.75,94.61 v32.46,94.59 v16.76,94.59 v1.93,94.59 | X1.47 45.54,6.66 38.79,13.41 11.51,13.41 11.51,43.1 10.62,43.99 10.62,46 10.11,46.66 10.11,48.66 IC1.A09
A20  (via drill 0.41 pad 0.41, 0.41 pad 0.61)
  Top 0.203: U$1.41 v35.1,95.38 | U$3.41 51.09,95.38 v51.1,95.4 | U$2.41 v67.26,95.38 67.39,95.38 68.89,96.88 74.09,96.88 XC9572XL(RAM).17 | X1.48 48.08,6.78 XC9572XL(BUS).49 | IC1.B08 12.7,49.08 11.28,47.65 7.92,47.65 1.25,54.33 1.25,89.18 1.37,89.31 1.37,93.83 1.22,93.98 1.22,95.33 v1.25,95.35 | U$4.41 v19.49,95.38
  Bottom 0.203: 51.09,95.38 v35.1,95.38 v19.49,95.38 19.39,95.38 19.36,95.35 | 51.09,95.38 v51.1,95.4 | 51.09,95.38 v67.26,95.38 | X1.48 48.08,5 39.17,13.92 13.54,13.92 13.54,42.55 11.63,44.45 11.63,46.28 11.23,46.84 11.23,47.6 12.09,48.56 13.6,48.56 IC1.B08 | v1.25,95.35 19.36,95.35 | 19.36,95.35 19.46,95.35
A21  (via drill 0.41, 0.41 pad 0.61)
  Top 0.203: X1.50 53.16,7.47 XC9572XL(BUS).50 | XC9572XL(RAM).2 86.64,89.81 95.35,89.81 v95.96,89.2 | IC1.A08 14.39,47.28 15.34,46.33 17.2,46.33 26.11,55.24 26.11,58.42 30.58,62.89 31.04,62.89 31.65,62.28 32.66,62.28 33.17,62.79 34.19,62.79 34.9,62.08 36.37,62.08 37.03,62.74 37.95,62.74 38.35,62.33 39.62,62.33 40.39,63.09 40.39,63.86 v47.9,71.37 48.46,71.93 48.46,82.55 48.55,82.58 U$3.25 | U$4.25 19.36,82.58 v19.36,79.65 | v32.77,79.6 32.77,82.55 33.82,82.55 U$1.25 | U$2.25 64.31,82.58 64.31,79.86 v55.83,71.37 | v35.46,71.37 v35.46,76.86
  Bottom 0.203: 49.82,7.76 43.16,14.43 14.07,14.43 14.07,42.67 12.14,44.6 12.14,47.1 IC1.A08 | 49.82,7.76 49.07,7.01 49.07,1.02 49.78,0.38 98.91,0.38 99.62,1.02 99.62,85.65 99.52,85.65 v95.96,89.2 | 49.82,7.76 51.5,7.76 53.16,6.1 X1.50 | v19.36,79.65 32.72,79.65 v32.77,79.6 35.46,76.91 v35.46,76.86 | v55.83,71.37 v47.9,71.37 v35.46,71.37
A22  (via drill 0.41 pad 0.61)
  Top 0.203: XC9572XL(BUS).51 53.49,7.85 55.7,7.85 X1.51 | XC9572XL(RAM).1 86.89,89.36 94.34,89.36 v94.94,88.75
  Bottom 0.203: IC1.B07 14.46,47.28 13.16,46.02 13.16,44.96 13.77,44.4 16.08,42.09 16.08,14.88 45.24,14.88 54.46,5.66 54.46,4.42 | 54.46,4.42 54.46,3.05 54.1,2.69 52.32,2.69 51.87,3.15 51.87,5.89 51.51,6.25 49.94,6.25 49.58,5.89 49.58,1.32 50.01,0.89 98.78,0.89 99.21,1.32 99.21,84.53 99.16,84.53 v94.94,88.75 | 54.46,4.42 X1.51
A23  (via drill 0.41)
  Top 0.203: v98.2,8.89 98.4,8.69 98.4,6.25 97.64,5.49 96.37,5.49 93.12,2.23 58.24,2.23 X1.52 58.24,8.59 53.46,8.59 XC9572XL(BUS).52 | XC9572XL(RAM).64 88.55,88.54 93.27,88.54 v93.88,87.94
  Bottom 0.203: IC1.A07 14.29,45.31 15.75,45.31 16.97,44.09 16.97,43.28 16.59,42.9 16.59,15.39 47.27,15.39 51.33,11.33 58.24,11.33 X1.52 | v98.2,8.89 98.75,9.45 98.75,83.06 v93.88,87.94
AS
  Top 0.203: X1.6 76.02,22.78 76,22.76 58.05,22.76 XC9572XL(BUS).6
AS20  (via drill 0.41 pad 0.41)
  Top 0.203: v55.52,42.16 55.52,43.01 RN3.4 56.79,44.2 57.3,43.69 58.47,43.69 59.84,45.06 59.84,46.63 61.82,48.62 62.53,48.62 63.62,47.53 IC2.21 | XC9572XL(BUS).23 41.4,24.89 39.45,24.89 39.45,47.47 37.54,49.38 37.54,50.42 37.46,50.49 IC1.J02 39.6,50.87 40.59,49.89 41.6,49.89 42.16,50.44 47.09,50.44 51,54.36 51,59.64 69.04,77.72 74.55,77.72 XC9572XL(RAM).47
  Bottom 0.203: IC1.J02 39.35,50.87 41.55,48.67 44.35,48.67 50.85,42.16 v55.52,42.16
AUX0
  Top 0.203: XC9572XL(BUS).58 55.39,10.9 67.56,10.9 67.56,8.43 68.5,7.47 81.23,7.47 83.62,9.86 AUXPINS.1
AUX1
  Top 0.203: XC9572XL(BUS).57 55.22,10.36 67.18,10.36 67.18,7.77 68,6.96 82.65,6.96 83.54,7.85 AUXPINS.2
AVEC  (via drill 0.41)
  Top 0.203: IC1.E02 30.28,42.21 31.95,40.54 31.95,32.46 29.06,29.57 29.06,25.88 v29.03,25.86 | v37.13,18.9 40.11,18.9 40.11,18.39 42.75,15.72 43.36,15.72 44.15,14.94 44.15,14.53 43.54,13.93 XC9572XL(BUS).35
  Bottom 0.203: v37.13,18.9 29.01,18.9 29.03,18.92 v29.03,25.86
BERR
  Top 0.203: IC1.H01 37.46,44.42 35.36,42.32 35.36,27.3 X1.22 35.38,25.5 37.03,25.5 37.03,23.37 40.09,23.37 XC9572XL(BUS).27
BG
  Top 0.203: X1.11 63.32,24.82 63.3,24.79 56.55,24.79 XC9572XL(BUS).11
BG20
  Top 0.203: XC9572XL(BUS).32 39.1,20.83 34.29,20.83 34.29,23.01 31.65,23.01 31.65,20.22 29.62,20.22 28.96,19.56 18.09,19.56 18.09,22.96 arc-90 18.69,23.57 21.67,23.57 21.67,33.35 24.89,36.58 IC1.B02
BGACK
  Top 0.203: 56.25,25.2 60.76,25.2 60.78,25.22 X1.12 | 56.25,25.2 | 56.25,25.2 XC9572XL(BUS).12
  Bottom 0.203: IC1.C03 24.13,41.13 24.13,39.57 21.95,37.39 21.95,35.97 22.71,35.2 23.57,35.2 24.13,35.76 25.55,35.76 28.04,33.27 54.05,33.27 57.15,30.18 57.89,30.18 X1.12
BR
  Bottom 0.203: X1.13 58.24,28.47 56.49,30.23 50.7,30.23 48.72,32.21 | 48.72,32.21 48.72,32.26 | IC1.A01 26.94,32.66 48.26,32.66 48.72,32.21
CBACK
  Top 0.203: IC1.J01 39.61,49.43 42.32,49.43 42.72,49.84 47.24,49.84 51.61,54.2 51.61,59.54 69.29,77.22 74.75,77.22 XC9572XL(RAM).48
CBREQ
  Top 0.203: IC1.K01 46.76,50.87 50.49,54.61 50.49,59.84 68.78,78.23 74.35,78.23 XC9572XL(RAM).46
CDIS
  Top 0.203: RN2.4 12.94,76.16 14.47,74.63 JP5.2 14.47,71.99 15.24,71.22 15.7,71.22 18.44,68.48 18.44,67.77 IC1.H12
CIIN
  Top 0.203: IC1.L01 46.98,52.67 49.48,55.17 49.48,60.45 68.28,79.25 73.95,79.25 XC9572XL(RAM).44
CLK7M
  Top 0.254: 51.08,22.18 50.29,21.39 50.29,19.71 54.15,15.85 56.31,15.85 60.22,19.76 68.28,19.76 68.61,20.09 68.63,20.09 73.05,20.09 73.33,19.81 76.68,19.81 JP1.1 | 51.08,22.18 XC9572XL(BUS).15 | IC4.4 49.63,29.44 49.63,25.86 51.77,23.72 51.77,22.86 51.08,22.18
CLK7M_RAW
  Top 0.406: X1.15 53.14,27.28 IC4.2
CLKCPU  (via drill 0.41, 0.5, 0.6)
  Top 0.254: IC5.4 61.8,18.8 60.12,18.8 v59.52,18.2 | 49.07,29.26 49.07,25.6 50.62,24.06 XC9572XL(BUS).16 49.78,21.56 49.78,19.3 v53.87,15.21 | 49.73,48.01 56.13,54.41 56.13,55.9 IC2.11 58.55,56.52 63.45,61.42
  Top 0.305: 49.73,48.01 v49.73,38.1 49.73,30.48 49.07,29.82 49.07,29.26 | 63.45,61.42 63.45,62.43 61.01,64.87 61.01,66.45 70.05,75.49 76.68,75.49 v79.2,78 | XC9572XL(RAM).16 79.25,92.32 79.2,92.22 v79.2,83.72
  Bottom 0.254: v53.87,15.21 56.64,15.16 57.78,16.33 59.52,18.07 v59.52,18.2
  Bottom 0.305: v79.2,83.72 v79.2,78
  Bottom 0.406: v49.73,38.1 35.87,38.1 IC1.E01
CLKCPU_RAW
  Top 0.254: IC5.2 65.17,17.88 67.56,17.88 69.14,19.46 72.39,19.46 73.15,18.69 73.15,16.92 74.4,15.67 JP1.2
CLKEXT
  Top 0.254: OSC1.3 78.21,12.85 JP1.3
CPCS  (via drill 0.41)
  Top 0.203: XC9572XL(BUS).62 56.11,13.01 v64.34,13.01
  Bottom 0.203: IC2.29 74.71,39.46 64.34,29.06 v64.34,13.01
CPSENSE
  Top 0.203: IC2.4 59.97,61.9 53.65,55.58 53.65,53.7 42.32,42.37 42.32,28.83 41.73,28.25 41.73,26.42 42.72,25.45 42.96,25.45 XC9572XL(BUS).20
  Bottom 0.203: R3.2 62.43,61.9 IC2.4
D0
  Top 0.203: U$4.14 10.79,87.38 10.79,79.55 17.92,72.42 IC1.K13
  Bottom 0.203: 60.3,63.7 IC2.3 59.53,64.52 42.47,64.52 35,57.05 33.33,57.05 32.36,58.01 29.52,58.01 26.16,61.37 22.81,61.37 21.23,62.94 20.37,62.94 16.66,66.65 16.66,68.12 19.51,70.97 IC1.K13
D1
  Top 0.203: IC1.K12 21.3,70.8 20.52,71.58 20.52,72.85 19.91,73.46 17.55,73.46 11.3,79.7 11.3,88.18 U$4.13
  Bottom 0.203: IC1.K12 20.57,69.9 20.57,68.02 20.27,67.72 20.27,66.6 20.98,65.89 23.06,65.89 29.87,59.08 32.82,59.08 40.95,67.21 61.82,67.21 63.94,65.1 IC2.2
D2
  Top 0.203: U$4.9 12.32,91.36 12.32,80.06 17.75,74.62 20.9,74.62 IC1.L13
  Bottom 0.203: IC1.L13 20.62,74.22 20.62,71.93 20.22,71.53 20.22,70.97 18.44,69.19 18.44,67.77 20.93,65.28 22.96,65.28 29.67,58.57 32.97,58.57 40.95,66.55 61.04,66.55 62.09,65.5 IC2.1
D3
  Top 0.203: IC1.M13 22.91,76.22 22.18,76.96 18.06,76.96 14.35,80.67 14.35,88.18 U$4.32
  Bottom 0.203: 65.72,65.48 IC2.68 65.08,66.14 63.6,66.14 61.87,67.87 38.61,67.87 31.22,60.48 29.23,60.48 21.29,68.43 21.29,69.19 22.3,70.21 22.3,71.12 21.79,71.63 21.79,73.2 23.1,74.51 IC1.M13
D4
  Top 0.203: IC1.L12 23.1,74.59 21.29,76.4 17.91,76.4 13.84,80.47 13.84,90.58 U$4.35
  Bottom 0.203: IC2.67 62.7,68.53 38.66,68.53 31.09,60.96 29.52,60.96 22,68.48 22,69.14 22.81,69.95 22.81,72.14 arc-90 IC1.L12
D5
  Top 0.203: U$4.10 11.81,90.58 11.81,79.91 17.86,73.97 20.19,73.97 21.26,72.9 21.26,72.06 23.12,70.2 23.12,70.12 IC1.K11
  Bottom 0.203: IC2.66 66.11,67.29 63.8,69.6 36.12,69.6 34.39,67.84 33.38,67.84 32.64,68.58 32.08,68.58 30.73,69.88 29.9,69.88 27.28,67.26 26.06,67.26 25.3,68.02 23.91,68.02 IC1.K11
D6
  Top 0.203: U$4.31 14.86,87.38 14.86,80.87 18.21,77.52 23.01,77.52 23.82,77.52 24.84,76.5 24.84,74.22 IC1.M12
  Bottom 0.203: IC2.65 64.72,70.1 33.53,70.1 33.02,69.6 31.65,69.6 30.89,70.36 29.62,70.36 27.03,67.77 26.26,67.77 25.55,68.48 24.49,68.48 24.18,68.78 24.18,69.24 23.32,70.1 23.32,71.22 24.89,72.8 IC1.M12
D7
  Top 0.203: U$4.36 13.34,91.38 13.34,80.26 17.7,75.89 21.08,75.89 22.4,74.57 22.4,73.66 21.95,73.2 21.95,71.98 22.86,71.07 24.45,71.07 IC1.L11
  Bottom 0.203: IC1.L11 27.04,70.63 28.09,71.68 29.26,71.68 29.62,71.32 30.58,71.32 31.39,72.14 64.87,72.14 67.92,69.09 IC2.64
D8
  Top 0.203: U$1.14 26.42,87.38 26.42,79.34 IC1.N13
  Bottom 0.203: IC2.62 71.14,70.87 73,70.87 73.97,69.9 75.13,69.9 75.69,70.46 75.69,72.29 73.3,74.68 32.31,74.68 29.17,77.81 IC1.N13
D9
  Top 0.203: IC1.M11 25.96,73.15 25.96,74.68 25.25,75.39 25.25,76.71 26.92,78.38 26.92,88.18 U$1.13
  Bottom 0.203: IC1.M11 26.69,73.88 28.04,75.23 29.01,75.23 30.12,74.07 31.24,74.07 31.65,73.66 71.94,73.66 IC2.60
D10
  Top 0.203: U$1.10 27.46,90.58 27.46,78.26 25.65,76.45 25.65,75.59 26.77,74.47 26.77,73.97 27.84,72.9 27.84,71.53 27.33,71.02 27.33,69.48 IC1.L10
  Bottom 0.203: IC1.L10 25.98,69.55 24.59,69.55 23.82,70.31 23.82,70.92 25.45,72.54 25.45,73.05 26.01,73.61 26.01,74.57 25.4,75.18 25.4,75.89 23.88,77.42 23.88,78.13 24.64,78.89 28.91,78.89 32.61,75.18 73.61,75.18 76.25,72.54 76.25,70.26 75.34,69.34 73.17,69.34 IC2.59
D11
  Top 0.203: U$1.9 27.96,91.38 27.96,77.3 IC1.N12
  Bottom 0.203: IC1.N12 30.1,76.02 31.95,74.17 72.95,74.17 74.71,72.41 IC2.58
D12
  Top 0.203: U$1.36 28.47,91.38 28.47,75.67 27.53,74.73 27.53,73.81 28.45,72.9 28.45,70.67 arc90 IC1.M10
  Bottom 0.203: IC1.M10 28.72,70.87 30.79,70.87 31.55,71.63 33.22,71.63 34.21,70.64 65.56,70.64 69.6,66.6 74.02,66.6 IC2.57
D13
  Top 0.203: U$1.35 28.98,90.58 28.98,74.72 IC1.N11
  Bottom 0.203: IC2.56 76.25,68.83 74.12,68.83 73.41,68.12 72.49,68.12 67.46,73.15 31.33,73.15 30.93,73.56 29.15,73.56 IC1.N11
D14
  Top 0.203: U$1.32 30.48,88.18 30.48,74.07 29.31,72.9 29.31,71.98 30.07,71.22 30.07,69.8 30.28,69.59 IC1.M09
  Bottom 0.203: 76.61,65.59 IC2.55 67.55,65.5 66.4,66.65 65.94,66.65 63.5,69.09 36.27,69.09 34.59,67.41 33.07,67.41 32.41,68.07 31.7,68.07 30.94,68.83 IC1.M09
D15
  Top 0.203: U$1.31 30.99,87.38 30.99,73.13 IC1.N10
  Bottom 0.203: IC2.54 76.22,67.29 75.13,68.38 74.42,68.38 73.66,67.61 72.19,67.61 67.16,72.64 30.28,72.64 IC1.N10
D16  (via drill 0.41 pad 0.25)
  Top 0.203: U$3.14 41.4,87.38 v41.4,75.82 36.21,70.63 IC1.N09 32.27,70.63 | IDE.4 95.56,76.25 95.56,72.14 94.94,71.53 89.72,71.53 IC2.50
  Bottom 0.203: X1.5 78.59,27.3 78.59,32.92 84.33,38.66 84.33,49.12 82.04,51.41 81.33,51.41 80.37,52.38 80.37,53.65 81.38,54.66 81.38,59.08 80.87,59.59 80.87,60.55 81.9,61.58 IC2.50 81.9,67.61 73.69,75.82 v41.4,75.82
D17  (via drill 0.41 pad 0.25)
  Top 0.203: 97.28,75.18 IDE.6 95.96,74.07 95.96,71.42 95.58,71.12 95.58,69.55 95.1,69.06 89.89,69.06 84.48,63.65 84.07,63.65 81.89,61.47 IC2.49 | U$3.13 42.16,88.18 v42.16,76.45 42.16,75.49 36.78,70.1 33.53,70.1 32.61,69.19 32.61,67.77 32.08,67.23 IC1.M08 32.05,67.06
  Bottom 0.203: X1.4 81.1,33.71 86.31,38.91 86.31,49.78 86.33,49.84 83.8,52.38 82.86,52.38 82.4,51.92 81.43,51.92 80.87,52.48 80.87,53.39 81.89,54.41 IC2.49 82.6,60.81 82.6,62.74 83.29,63.42 83.29,66.88 73.71,76.45 v42.16,76.45
D18  (via drill 0.41 pad 0.25)
  Top 0.203: U$3.10 42.93,90.58 v42.93,77.09 42.93,75.39 36.37,68.83 IC1.N08 | IC2.48 90.42,68.63 95.4,68.63 95.96,69.19 95.96,70.81 97.03,71.83 IDE.8
  Bottom 0.203: X1.3 83.64,34.67 87.33,38.35 87.33,52.58 85.65,54.25 84.78,54.25 84.23,53.7 83.31,53.7 82.6,54.41 82.6,58.98 83.69,60.07 IC2.48 84.23,62.44 84.23,66.75 73.89,77.09 v42.93,77.09
D19  (via drill 0.41 pad 0.25)
  Top 0.203: U$3.9 43.69,91.38 v43.69,77.72 43.69,75.06 IC1.N07 | IDE.10 97.03,69.6 95.56,68.12 95.56,63.96 87.94,63.96 84.53,60.5 84.53,59.15 IC2.47
  Bottom 0.203: X1.2 86.21,27.3 86.21,33.63 88.39,35.81 88.39,54.97 87.68,55.68 86.87,55.68 86.31,55.14 84.84,55.14 83.69,56.31 IC2.47 83.69,58.9 84.53,59.74 84.53,60.5 84.89,60.86 84.89,66.8 73.97,77.72 v43.69,77.72
D20  (via drill 0.41 pad 0.25)
  Top 0.203: U$3.36 44.45,91.38 v44.45,78.46 44.45,74.27 36.17,65.99 34.62,65.99 IC1.M07 | IC2.46 88.88,63.52 95.96,63.52 95.96,66.5 IDE.12
  Bottom 0.203: X1.1 88.7,27.3 88.9,27.51 88.9,55.14 88.01,56.08 86.54,56.08 86.06,55.58 85.04,55.58 84.48,56.13 84.48,57 85.49,58.01 IC2.46 85.49,66.85 73.88,78.46 v44.45,78.46
D21  (via drill 0.41 pad 0.25)
  Top 0.203: U$3.35 45.21,90.58 v45.21,79.1 45.21,72.99 IC1.N06 | IDE.14 97.28,65.02 98.25,64.06 98.25,61.21 96.57,61.21 95.96,60.66 95.96,58.47 88.95,58.47 87.78,57.25 86.22,57.25 IC2.45
  Bottom 0.203: X1.64 88.72,5.71 89.74,6.73 89.74,30.48 89.41,30.81 89.41,55.27 88.16,56.52 IC2.45 86.11,57.13 86.11,58.93 86.51,59.33 86.51,66.45 73.86,79.1 v45.21,79.1
D22  (via drill 0.41 pad 0.25)
  Top 0.203: U$3.32 45.97,88.18 v45.97,79.73 45.97,72.24 38,64.26 36.48,64.26 IC1.M06 | IDE.16 95.56,61.06 95.56,58.88 87.8,58.88 IC2.44
  Bottom 0.203: X1.63 86.18,3.68 87.12,2.74 90.17,2.74 90.17,30.84 89.86,31.14 89.86,55.68 IC2.44 87.28,66.33 73.89,79.73 v45.97,79.73
D23  (via drill 0.41 pad 0.25)
  Top 0.203: U$3.31 46.74,87.38 46.74,70.92 IC1.N05 | v80.41,56.09 82.32,56.09 IC2.42 85.2,54.72 86.77,56.29 97.79,56.29 98.5,57 98.5,58.47 IDE.18
  Bottom 0.203: X1.62 84.91,5.66 84.91,34.82 87.88,37.8 87.83,52.83 86,54.67 IC2.42 | IC1.N05 41.7,65.89 60.4,65.89 64.72,61.57 74.07,61.57 79.55,56.09 v80.41,56.09
D24  (via drill 0.41, 0.41 pad 0.25)
  Top 0.203: U$2.14 58.24,87.38 58.24,80.62 58.24,80.52 58.24,80.34 39.55,61.65 IC1.M05 | IC2.40 v80.21,54.61 79.25,55.57 79.25,56.54 79.5,56.79 84.38,56.79 87.53,59.94 IDE.17 | XC9572XL(RAM).62 85.63,83.92 86.87,83.92 89.36,86.41 v92.41,86.41
  Bottom 0.203: X1.61 82.35,5.66 82.35,34.14 86.82,38.76 86.82,50.11 83.72,53.14 82.11,53.14 IC2.40 | IC1.M05 38.91,61.65 42.29,65.02 60.5,65.02 64.41,61.11 73.61,61.11 80.11,54.61 v80.21,54.61 | IDE.17 95.96,61.37 95.96,82.91 93.83,84.99 v92.41,86.41
D25  (via drill 0.41, 0.41 pad 0.25)
  Top 0.203: U$2.13 58.75,88.18 58.75,80.24 41.06,62.55 IC1.N04 | IC2.39 83.16,51.66 81.08,51.66 v78.28,54.46 78.28,56.64 78.94,57.3 84.07,57.3 89.26,62.48 IDE.15 | XC9572XL(RAM).61 85.33,83.52 87.88,83.52 89.92,85.55 v92.05,85.55
  Bottom 0.203: X1.60 79.83,5.66 79.83,33.22 85.29,38.68 85.29,49.53 IC2.39 | IC1.N04 43.41,64.01 57.86,64.01 63.75,58.12 73.97,58.12 77.62,54.46 v78.28,54.46 | IDE.15 95.56,63.55 95.56,82.04 v92.05,85.55
D26  (via drill 0.41)
  Top 0.203: U$2.9 59.77,91.38 59.77,79.91 42.88,63.02 42.88,59.88 IC1.N03 | IC2.38 77.27,53.96 77.27,56.39 79.96,59.08 82.35,59.08 88.29,65.02 v92.1,65.02 IDE.13 | XC9572XL(RAM).58 84.98,81.74 v89,81.74
  Bottom 0.203: X1.59 77.04,5.61 77.04,32.44 83.77,39.17 83.77,48.82 82.09,50.49 80.73,50.49 IC2.38 80.1,51.29 73.73,57.66 61.32,57.66 57.2,61.77 45.82,61.77 43.89,59.84 42.86,59.84 IC1.N03 | v89,81.74 92.1,78.99 v92.1,65.02
D27  (via drill 0.41, 0.6 pad 0.41)
  Top 0.203: U$2.10 59.26,90.58 59.26,80.11 42.32,63.17 42.32,61.27 41.5,60.45 40.34,60.45 39.74,59.85 IC1.M04 | 82,49.23 IC2.37 82.05,49.17 83.36,49.17 84.99,50.8 84.99,51.56 83.87,52.68 83.87,53.34 84.73,54.2 85.34,54.2 86.87,55.73 87.83,55.73 89.97,53.59 v93.37,53.59 | XC9572XL(RAM).59 84.93,82.5 v89.76,82.5
  Bottom 0.203: X1.58 74.75,5.61 74.75,31.24 82.75,39.24 82.75,48.47 IC2.37 81.34,49.89 79.81,49.89 74.52,55.17 62.64,55.17 61.67,56.13 61.67,56.64 57,61.32 46.38,61.32 43.74,58.67 42.01,58.67 41.5,59.18 39.93,59.18 IC1.M04 | v89.76,82.5 93.07,79.5 93.07,68.99 IDE.11 93.12,65.99 93.12,53.85 v93.37,53.59
D28
  Top 0.203: IDE.9 89.97,70.1 74.57,54.71 74.57,53.06 IC2.36 | IC1.N02 44.96,58.37 44.96,62.97 61.29,79.3 61.29,88.18 U$2.32 66.29,88.18 66.9,88.8 67.92,88.8 71.75,85 XC9572XL(RAM).33
  Bottom 0.203: X1.57 72.21,5.66 72.21,30.79 81.28,39.88 81.28,47.75 79.7,49.33 IC2.36 | IC1.N02 46.48,59.94 55.42,59.94 60.66,54.71 61.72,54.71 61.98,54.46 71.93,54.46 77.06,49.33 IC2.36 | 77.92,49.33 IC2.36
D29
  Top 0.203: IC1.M03 41.12,58.12 43.23,58.12 44.4,59.28 44.4,63.12 60.78,79.5 60.78,90.58 U$2.35 69.77,90.58 XC9572XL(RAM).32 | IDE.7 88.8,72.64 72.29,56.13 72.29,53.54 78.3,47.53 IC2.35
  Bottom 0.203: X1.56 69.93,5.92 69.93,29.31 80.52,39.93 80.52,47.12 IC2.35 79.53,48.11 77.52,48.11 71.63,54 61.82,54 61.52,54.3 60.45,54.3 55.32,59.44 47.5,59.44 44.96,56.84 44.45,56.84 43.24,58.06 IC1.M03
D30
  Top 0.203: IC1.L04 38.96,58.06 40.08,59.18 41.66,59.18 42.16,58.67 43.08,58.67 43.84,59.44 43.84,63.27 60.27,79.7 60.27,91.38 U$2.36 69.68,91.38 XC9572XL(RAM).31 | IC2.34 71.78,52.26 71.78,58.57 80.62,67.41 82.7,67.41 88.54,73.25 93.12,73.25 94.49,74.62 IDE.5
  Bottom 0.203: 67.11,5.66 X1.55 69.42,8.05 69.42,29.67 79.35,39.52 79.35,46.13 77.94,47.53 IC2.34 71.36,52.68 61.57,52.68 60.86,51.97 59.89,51.97 54.56,57.3 46.08,57.3 45.06,56.29 44.3,56.29 43.28,57.3 42.27,57.3 41.81,56.84 40.13,56.84 38.92,58.06 IC1.L04
D31
  Top 0.203: IC2.33 76.13,45.74 75.18,46.69 72.95,46.69 71.12,48.51 71.12,58.52 80.42,67.82 82.4,67.82 88.34,73.76 91.19,73.76 94.49,77.06 IDE.3 | IC1.N01 46.45,63.74 61.8,79.1 61.8,87.38 U$2.31 66.3,87.38 67.06,88.14 67.82,88.14 71.65,84.31 71.97,84.34 XC9572XL(RAM).34
  Bottom 0.203: X1.54 67.39,8.51 67.39,28.55 78.3,39.44 IC2.33 78.14,45.9 76.48,45.9 70.1,52.27 61.87,52.27 61.11,51.51 59.64,51.51 54.89,56.26 IC1.N01
DS20  (via drill 0.41 pad 0.41)
  Top 0.203: v54.76,43.23 54.76,43.38 RN3.3 56.69,45.31 56.9,45.31 57.86,44.35 58.17,44.35 59.18,45.36 59.18,46.63 61.57,49.02 62.74,49.02 63.5,48.26 64.57,48.26 64.82,48.51 66.24,48.51 66.8,47.95 66.8,47.09 65.45,45.74 IC2.20 | XC9572XL(BUS).24 41.2,24.38 38.94,24.38 38.94,47.37 36.37,49.99 36.4,51.31 37.01,51.92 38.51,51.92 IC1.K02 41.31,52.67 42.32,51.66 46.79,51.66 49.99,54.86 49.99,60.2 68.53,78.74 74.15,78.74 XC9572XL(RAM).45
  Bottom 0.203: IC1.K02 41.3,52.67 50.74,43.23 v54.76,43.23
DSACK0  (via drill 0.41, 0.41 pad 0.41)
  Top 0.203: v66.65,13.72 63.5,13.74 63.22,13.46 56.36,13.44 XC9572XL(BUS).63 | RN3.1 52.73,43.61 v52.73,39.12 60.45,39.12 68.25,31.32 | 68.25,31.32 68.33,31.24 | v68.66,30.91 68.25,31.32
  Bottom 0.203: IC2.31 76.51,43.89 77.57,42.82 77.57,39.73 68.76,30.91 v68.66,30.91 68.66,30.69 66.88,28.91 66.88,13.95 v66.65,13.72 | v52.73,39.12 38.45,39.12 IC1.F01
DSACK1  (via drill 0.41, 0.41 pad 0.41)
  Top 0.203: v65.23,14.35 63.37,14.35 62.99,13.97 56.56,13.97 XC9572XL(BUS).64 | RN3.2 54.1,43.85 v54.1,39.88 60.91,39.88 67.5,33.24 68.46,32.27 v68.46,32.22
  Bottom 0.203: IC2.32 74.71,43.91 75.89,42.72 75.89,39.78 68.46,32.34 v68.46,32.22 68.34,32.22 64.85,28.73 64.85,14.73 v65.23,14.35 | IC1.G02 33.87,45.83 39.88,39.88 v54.1,39.88
DTACK
  Top 0.203: X1.10 65.86,24.38 56.85,24.38 XC9572XL(BUS).10
E
  Top 0.203: X1.20 40.46,25.4 41.59,25.4 XC9572XL(BUS).22
FC0  (via drill 0.41)
  Top 0.203: v38.73,17.37 38.73,15.98 41.66,13.06 41.68,13.05 42.01,13.05 XC9572XL(BUS).34 | IC1.D02 28.42,41.96 26.92,41.96 20.57,35.61 20.57,27.71 X1.28
  Bottom 0.203: v38.73,17.37 21.51,17.37 21.51,25.73 X1.28
FC1  (via drill 0.41)
  Top 0.203: IC1.C01 28.5,38.29 28.5,35.46 22.71,29.67 22.71,27.3 X1.27 | v39.37,18.29 39.37,17.8 42.55,14.61 XC9572XL(BUS).33
  Bottom 0.203: 28.5,38.29 IC1.C01 | v39.37,18.29 39.19,18.29 26.57,18.26 26.57,23.24 22.68,23.24 X1.27
FC2
  Top 0.203: 25.2,27.3 X1.26 | X1.26 25.22,25.45 22.2,25.45 22.2,23.06 18.95,23.06 18.69,22.81 18.69,22.76 18.64,22.71 18.64,20.02 23.93,20.02 24.49,20.57 28.96,20.57 29.16,20.78 29.16,23.47 34.75,23.47 34.75,21.34 39.3,21.34 XC9572XL(BUS).31 | IC1.D01 30.33,40.05 30.33,36.42 25.22,31.32 X1.26
GND  (via drill 0.41, 0.41 pad 0.41)
  Top 0.203: IDE.30 98.15,44.7 98.15,49.78 IDE.26 | X1.53 60.78,9.45 54.01,9.45 XC9572XL(BUS).54 | C2.2 arc-90 32.31,9.2 | v68.38,17.07 68.38,16.15 67.67,16.15 | IC2.41 85.49,50.18 81.79,46.48 79.05,46.48 78.74,46.79 77.52,46.79 77.11,46.38 76.1,46.38 74.93,47.55 73.43,47.55 v72.67,48.31 | XC9572XL(RAM).14 80.21,91.88 80.21,90.96 v81.05,90.12 | U$2.34 68.64,89.78 v68.81,89.61 | IC1.E11 14.53,60.27 14.53,61.92 16.05,63.45 IC1.G11 | 47.85,20.27 v48.9,21.29 | 44.14,10.26 44.12,10.26 | XC9572XL(RAM).54 81.96,81.94 84.15,79.76 v84.4,79.76 | R2.1 94.06,83.23 IDE.2
  Top 0.254: X1.16 50.62,25.88 52.43,24.08 52.43,22.79 XC9572XL(BUS).14 | OSC1.2 70.92,16.15 67.67,16.15 63.91,16.15 63.91,18.81 IC5.3 | 32.31,9.2 43.08,9.2 44.14,10.26 XC9572XL(BUS).41 47.09,13.21 v48.23,13.21 | XC9572XL(BUS).21 47.43,20.27 47.85,20.27 | XC9572XL(BUS).54 51.77,11.68 50.83,11.68 v50.27,11.12 | XC9572XL(RAM).21 77.57,90.56 v77.57,90.1 | XC9572XL(RAM).41 75.89,83.31 v77.09,83.31 | v5.87,91.54 5.87,88.98 U$4.12
  Top 0.305: C1.2 30.63,19.61 32.18,19.61 arc90 v32.33,19.76
  Top 0.406: v59.08,15.7 63.45,15.7 63.91,16.15 | IC4.3 52.19,36.32 58.09,36.32 JP7.1 | IC1.E03 IC1.F03 IC1.G03 | IC2.9 IC2.7 | IC2.6 IC2.8 | IDE.26 IDE.24 IDE.22 | IC1.C09 14.12,50.91 15.95,49.08 IC1.C07
  Top 0.813: U1.1 arc-90 27.56,15.95 28.7,15.95 arc90 28.85,16.1 C1.2
  Bottom 0.203: 30.38,19.74 v32.33,19.76 | C12.2 78.69,88.98 v77.57,90.1 | v23.04,78.64 23.7,79.27 29.26,79.27 30.33,78.23 v32.13,78.23
  Bottom 0.305: IC2.12 IC2.14 | C12.2 79.2,88.27 80.67,88.27 v81,88.59 81,90.07 v81.05,90.12
  Bottom 0.406: IC1.L09 IC1.L08 IC1.L07 | v59.08,15.7 60.78,15.7 60.78,12.09 | IC2.30 71.17,43.94 62.23,35 JP7.1 | IC1.G03 30.68,50.47 C6.2 | C12.2 78.69,87.83 77.98,87.83 | C13.2 78.41,60.21 IC2.51 | IC2.5 | IC2.5 IC2.6 | IC2.7 | IC2.7 IC2.8 | IDE.19 IDE.22
  Bottom 0.61: 60.78,7.67 X1.53 60.78,12.09 53.9,12.09 C7.2 50.14,15.7 49.33,16.51 43.23,16.51 40.01,19.74 30.38,19.74 JTAG.5 30.38,23.67 46.53,23.67 48.46,21.74 C4.2
  Bottom 0.813: SPIPORT.4 93.57,93.73 84.66,93.73 79.2,88.27
  other vias: 52.88,24.79 34.16,9.19 25.73,18.44 65.35,9.04 45.24,16.87 52.35,13.72 92.63,4.98 73.03,15.34 24.87,56.24 26.95,58.27 21.36,52.55 26.95,54.36 23.01,57.94 8.56,88.9 16.48,89.81 24.31,88.85 31.75,89.89 40.06,88.9 47.57,89.81 51.08,91.39 56.36,88.85 63.83,89.92 76.63,96.42 37.47,77.47 70.89,59.94 69.98,56.34 69.77,47.09 71.45,45.52 70.43,50.24 2.41,88.24 30.2,55.58 4.6,3.45 50.65,34.24 48.31,34.29 50.6,32.16 48.06,29.67 47.29,42.52 87.27,19.15 87.48,13 87.53,32.21 60.05,42.06 65.74,37.29 73.86,59.23 67.94,64.21 73.58,62.59 67.44,59.28 36.96,90.98 35.13,90.93 20.65,90.98 21.11,59.39 19.48,62.69 93.37,29.21 93.37,27.23 88.24,80.16 90.68,84.79 38.02,43.28 42.44,46.79 94.28,91.03 97.08,89.56 12.83,97.38 28.32,97.38 43.26,97.38 59.61,97.54 5.31,97.38 83.36,72.34 60.58,56.29 95.83,2.13 92.08,9.19 34.26,76.25 82.04,75.54 11.84,93.01 19.58,54.25 21.41,48.54 19.38,50.62 18.19,53.19 23.98,49.86 47.45,63.04
  pour Top: 0,0 100.18,0 100.18,100.18 0,100.18
  pour Bottom: 0.15,-0.3 99.92,-0.3 99.92,100.23 0,100.23 0,-1.12
HALT  (via drill 0.41)
  Top 0.203: XC9572XL(BUS).17 47.42,23.11 48.08,25.04 X1.17 46.81,28.52 46.81,39.34 v44.27,41.91
  Bottom 0.203: IC1.H02 37.13,49.08 44.27,41.94 v44.27,41.91
IDECS0
  Top 0.203: IDE.37 95.96,33.07 95.96,29.87 95.61,29.52 95.61,22 94.64,21.03 84.23,21.03 83.16,19.96 80.31,19.96 79.65,20.6 59.53,20.52 XC9572XL(BUS).1
IDECS1
  Top 0.203: IDE.38 98.2,33.38 98.2,31.19 96.11,29.11 96.11,16.76 93.12,13.77 81.99,13.77 77.19,8.97 69.47,8.97 68.78,9.65 68.78,12.29 56.12,12.29 XC9572XL(BUS).61
IDEINT  (via drill 0.41)
  Top 0.203: XC9572XL(RAM).57 84.78,81.23 88.54,81.23 v90.58,79.2 90.58,80.47 R2.2 | IDE.31 v92.28,44.35
  Bottom 0.203: v92.28,44.35 92.3,58.06 90.58,59.79 v90.58,79.2
IDEWAIT  (via drill 0.41)
  Top 0.203: XC9572XL(BUS).2 59.1,20.98 59.1,21.01 80.06,21.01 80.67,20.37 82.7,20.37 83.82,21.49 94.39,21.49 95,22.1 95,29.62 95.56,30.18 95.56,32.56 94.89,33.22 94.13,33.22 93.37,33.98 93.37,34.95 94.23,35.81 97.54,35.81 98.2,36.5 98.2,40.28 97.38,41.1 96.47,41.1 95.91,41.66 95.91,45.82 IDE.27 93.88,47.24 v90.58,50.55 | XC9572XL(RAM).52 84.19,78.28 85.53,78.28 v85.53,74.68
  Bottom 0.203: v90.58,50.55 90.58,56.79 88.54,58.83 88.54,75.01 R1.2 86.9,76.05 v85.53,74.68
INT2  (via drill 0.41)
  Top 0.203: A500.2 95.61,13.21 90.4,13.21 88.62,11.43 85.88,11.43 84.63,12.68 82.12,12.68 77.85,8.41 69.19,8.41 68.38,9.22 68.38,11.84 55.87,11.84 XC9572XL(BUS).60 | XC9572XL(RAM).63 85.83,84.43 86.67,84.43 89.51,87.27 v92.71,87.27
  Bottom 0.203: A500.2 98.35,15.9 98.35,81.69 94.69,85.29 v92.71,87.27
INTCYCLE  (via drill 0.41)
  Top 0.203: XC9572XL(BUS).59 55.62,11.38 67.97,11.38 67.97,8.79 68.81,7.95 78.66,7.95 82.8,12.09 84.51,12.09 85.72,10.87 v91.39,10.87 | XC9572XL(RAM).56 84.84,80.47 v86.51,80.47
  Bottom 0.203: v91.39,10.87 91.39,31.9 91.24,32.05 91.24,57.15 89.41,59.13 89.41,77.22 86.51,80.11 v86.51,80.47
IOR  (via drill 0.41)
  Top 0.203: XC9572XL(BUS).5 | XC9572XL(BUS).5 58.35,22.35 93.83,22.35 94.13,22.66 94.13,29.72 92.61,31.24 92.61,35.1 v93.57,36.07
  Bottom 0.203: IDE.25 93.42,49.78 93.4,49.73 93.4,36.25 v93.57,36.07
IOW  (via drill 0.41)
  Top 0.203: v93.27,32.92 93.17,32.82 93.17,31.34 94.54,29.97 94.54,22.35 94.13,21.95 58.66,21.95 XC9572XL(BUS).4
  Bottom 0.203: IDE.23 92.91,52.32 92.91,33.2 v93.27,32.92
IPL0  (via drill 0.41)
  Top 0.203: v28.25,43.48 28.3,43.48 31.39,40.39 31.39,36.47 27.74,32.82 27.74,27.3 X1.25